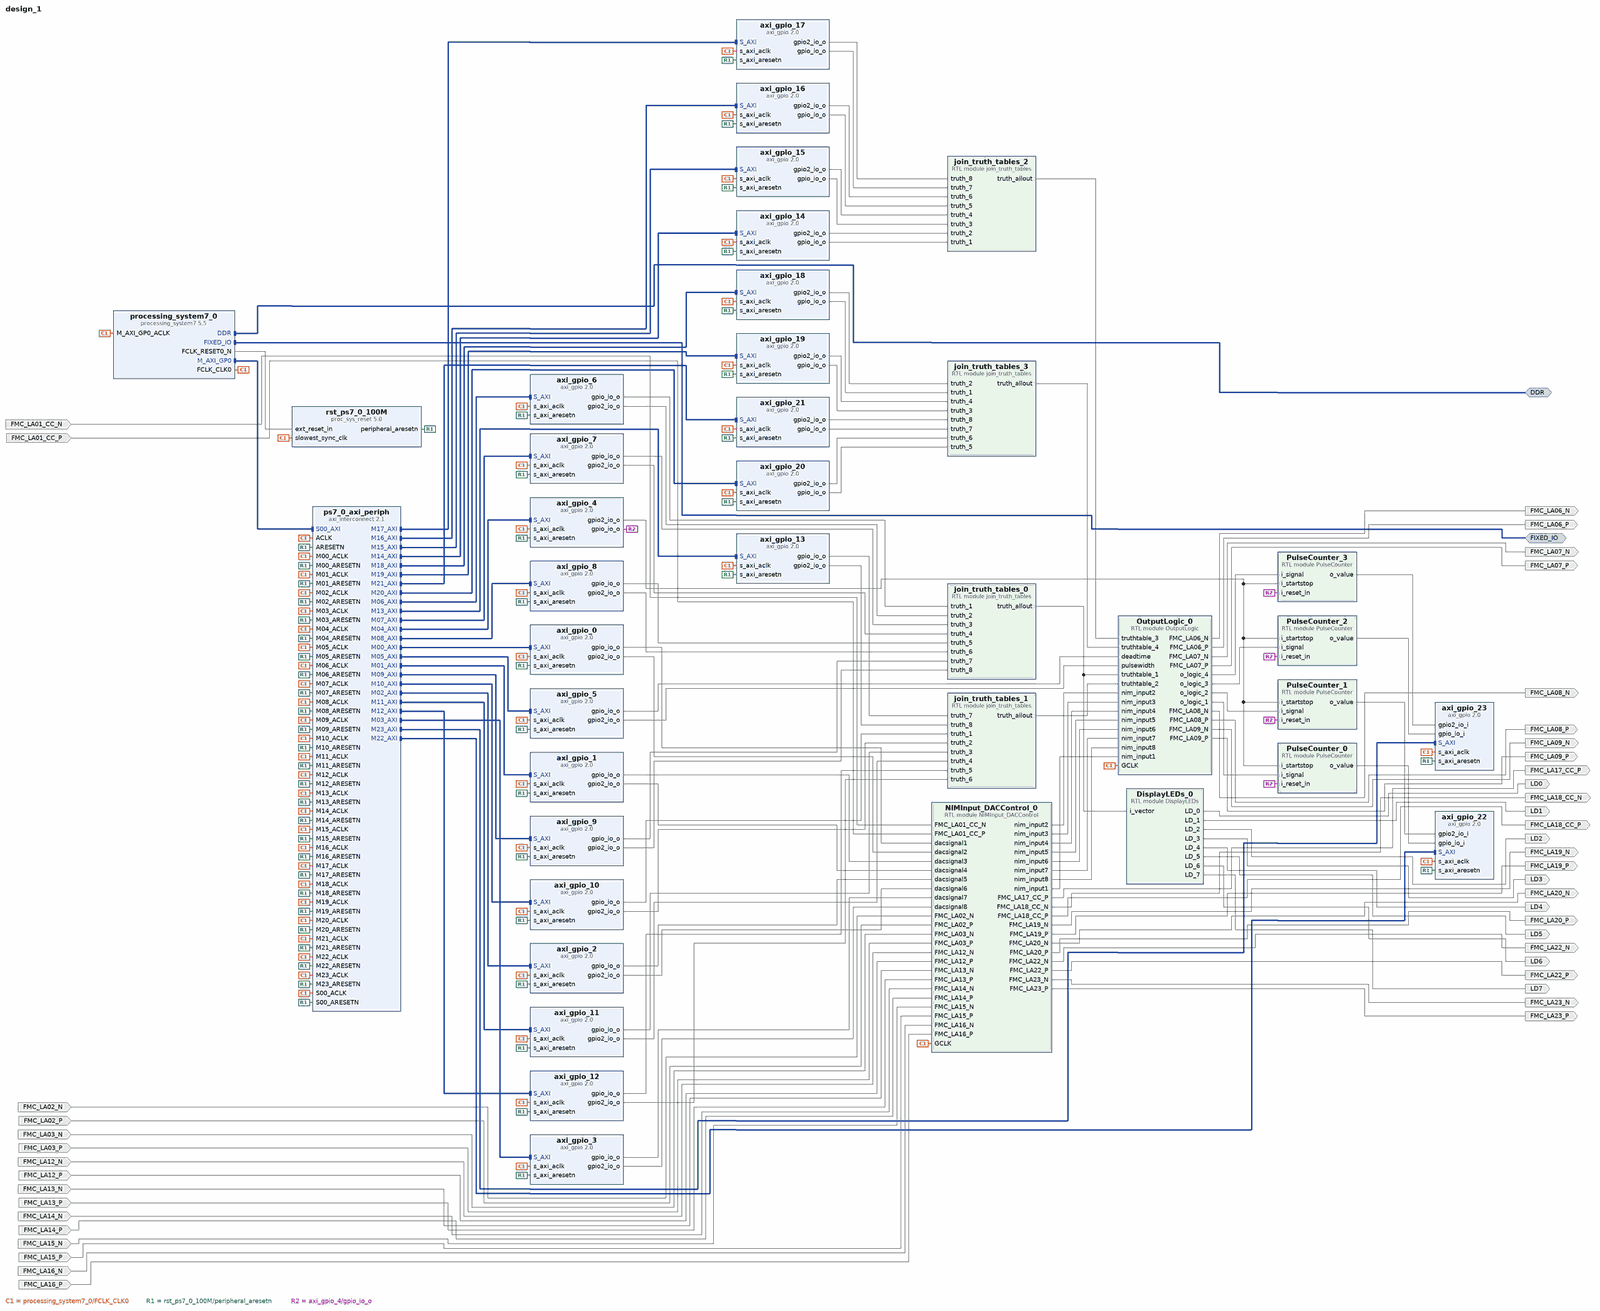
[diagram p0: block diagram of the top level, whole]
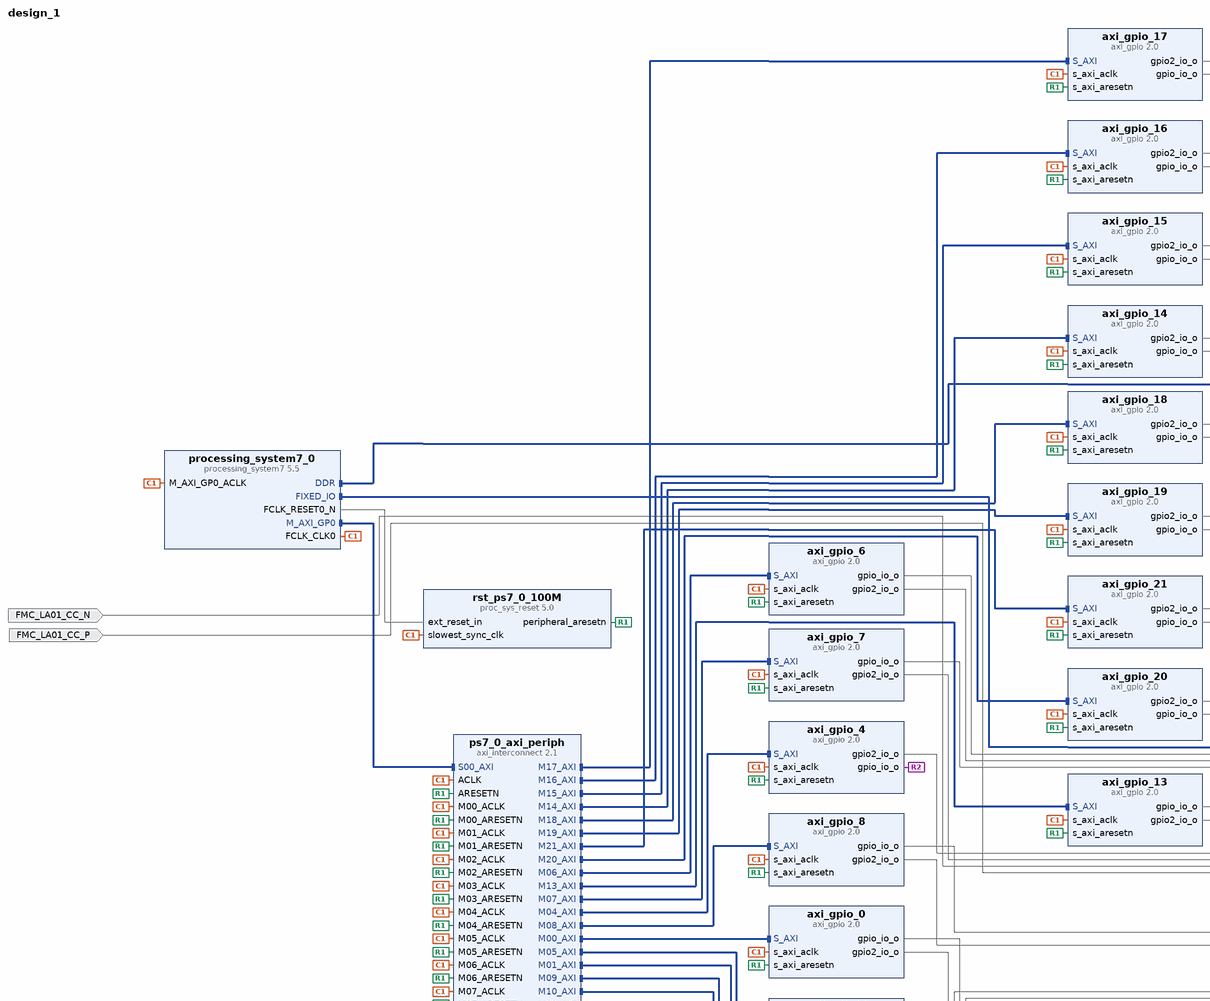
[diagram p1: block diagram of the top level, upper left part]
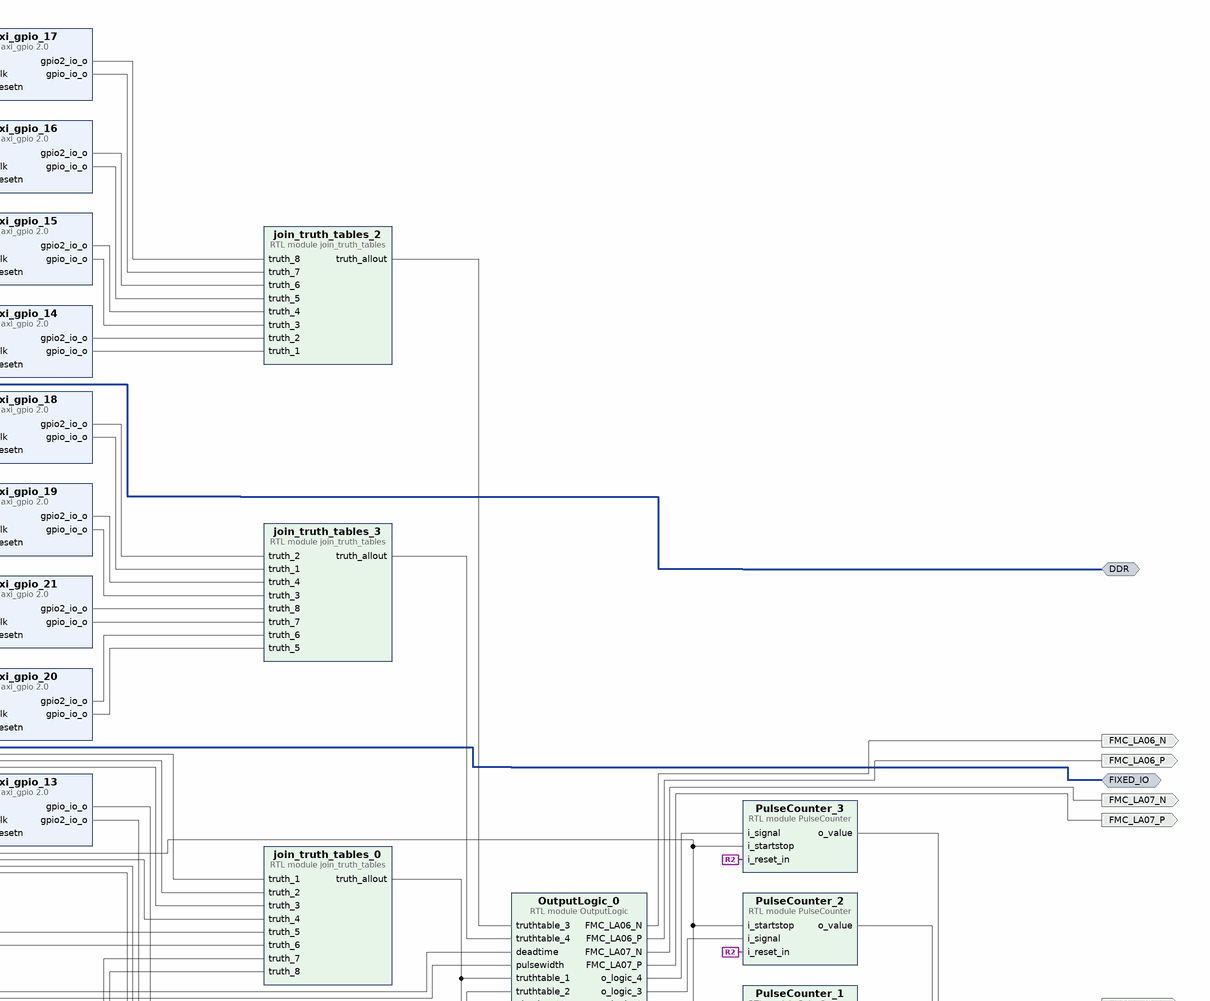
[diagram p2: block diagram of the top level, upper right part]
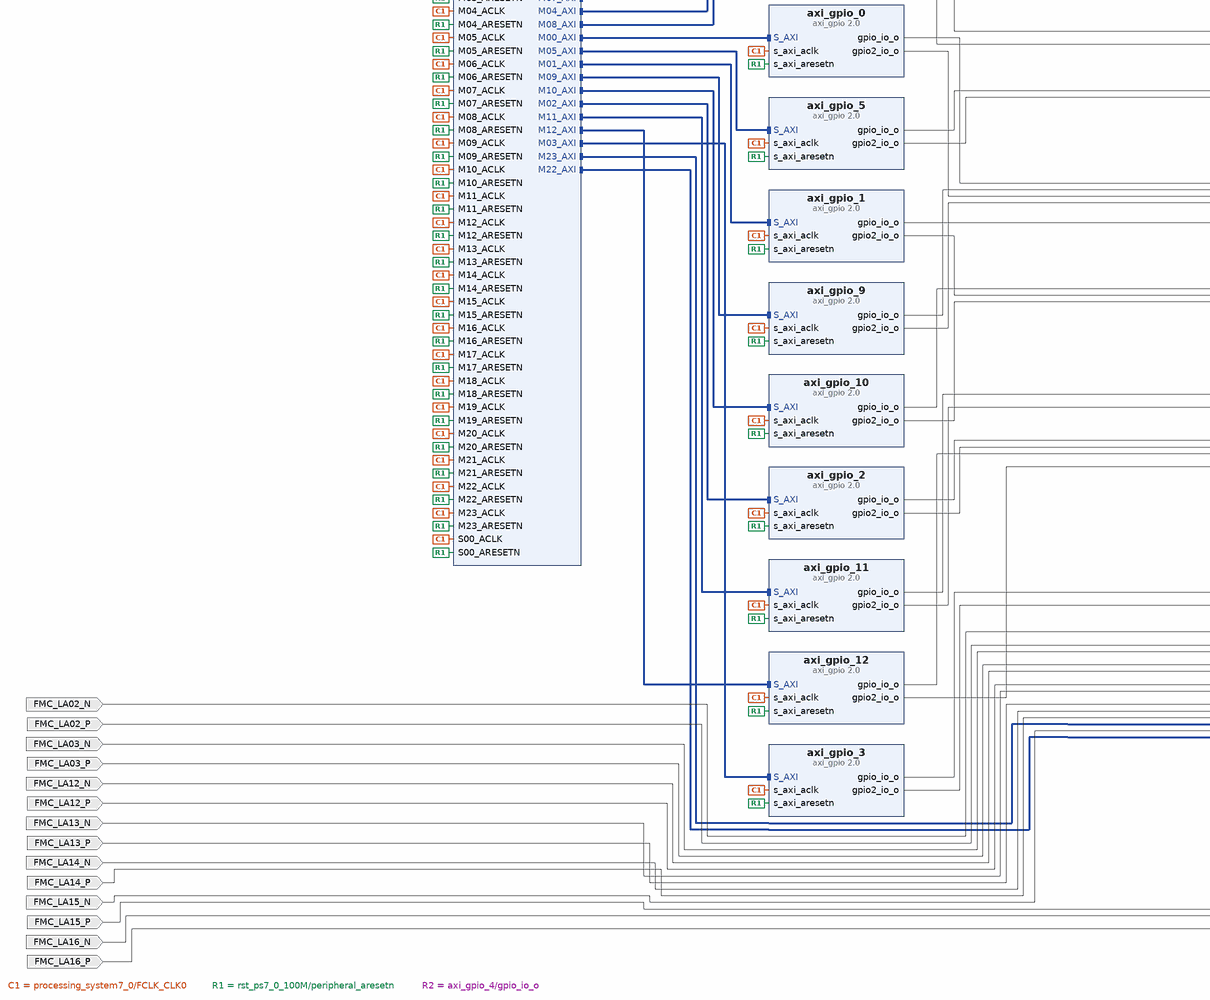
[diagram p3: block diagram of the top level, lower left part]
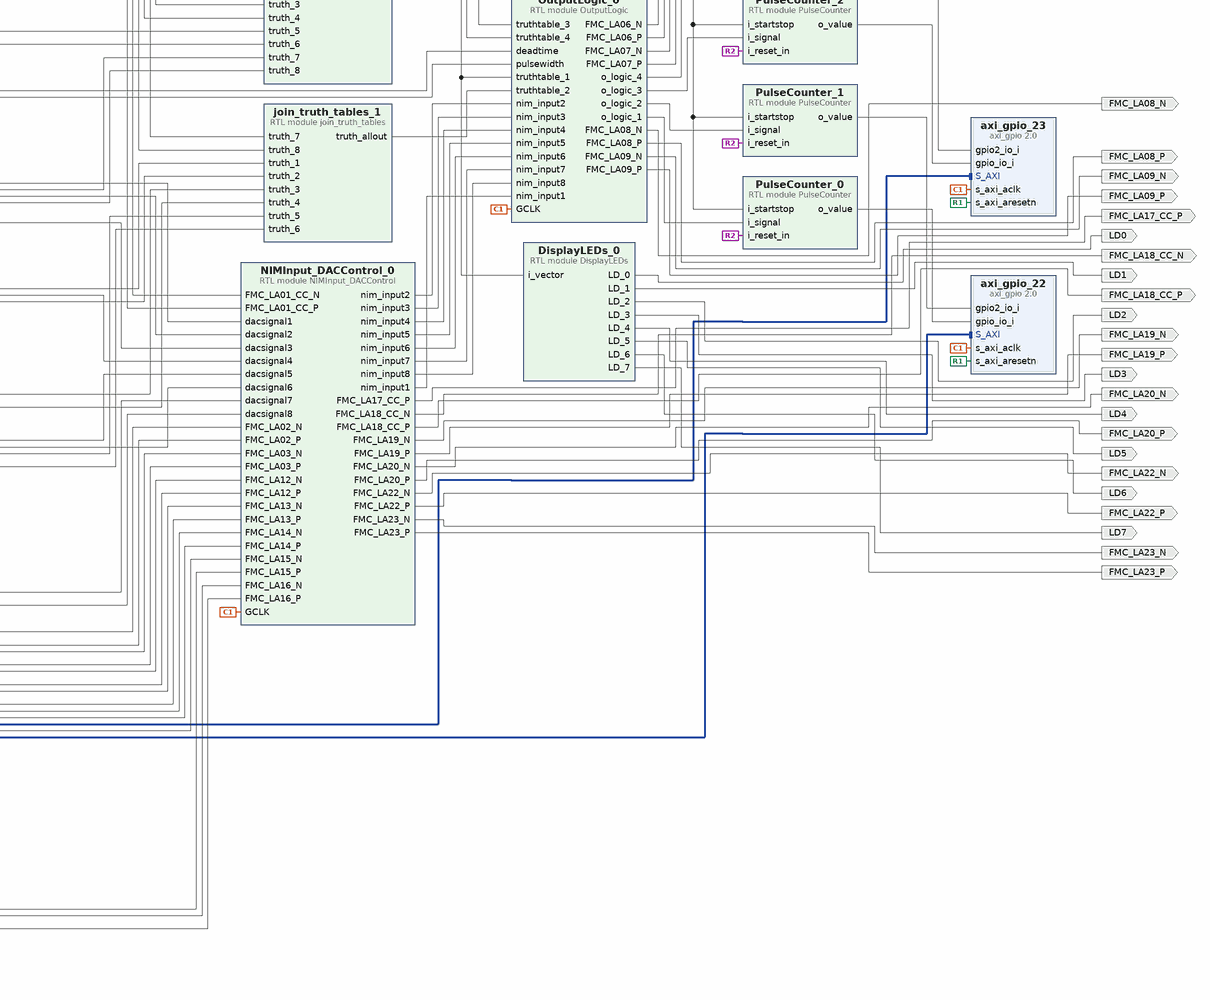
[diagram p4: block diagram of the top level, lower right part]
# Vivado block design design_1, xc7z020clg484-1, Vivado 2019.1
create_bd_design design_1

create_bd_intf_port -mode Master -vlnv xilinx.com:interface:ddrx_rtl:1.0 DDR
create_bd_intf_port -mode Master -vlnv xilinx.com:display_processing_system7:fixedio_rtl:1.0 FIXED_IO
create_bd_port -dir I FMC_LA01_CC_N
create_bd_port -dir I FMC_LA01_CC_P
create_bd_port -dir I FMC_LA02_N
create_bd_port -dir I FMC_LA02_P
create_bd_port -dir I FMC_LA03_N
create_bd_port -dir I FMC_LA03_P
create_bd_port -dir I FMC_LA12_N
create_bd_port -dir I FMC_LA12_P
create_bd_port -dir I FMC_LA13_N
create_bd_port -dir I FMC_LA13_P
create_bd_port -dir I FMC_LA14_N
create_bd_port -dir I FMC_LA14_P
create_bd_port -dir I FMC_LA15_N
create_bd_port -dir I FMC_LA15_P
create_bd_port -dir I FMC_LA16_N
create_bd_port -dir I FMC_LA16_P
create_bd_port -dir O FMC_LA17_CC_P
create_bd_port -dir O FMC_LA18_CC_N
create_bd_port -dir O FMC_LA18_CC_P
create_bd_port -dir O FMC_LA19_N
create_bd_port -dir O FMC_LA19_P
create_bd_port -dir O FMC_LA20_N
create_bd_port -dir O FMC_LA20_P
create_bd_port -dir O FMC_LA22_N
create_bd_port -dir O FMC_LA22_P
create_bd_port -dir O FMC_LA23_N
create_bd_port -dir O FMC_LA23_P
create_bd_port -dir O FMC_LA06_N
create_bd_port -dir O FMC_LA06_P
create_bd_port -dir O FMC_LA07_N
create_bd_port -dir O FMC_LA07_P
create_bd_port -dir O FMC_LA08_N
create_bd_port -dir O FMC_LA08_P
create_bd_port -dir O FMC_LA09_N
create_bd_port -dir O FMC_LA09_P
create_bd_port -dir O LD0
create_bd_port -dir O LD1
create_bd_port -dir O LD2
create_bd_port -dir O LD3
create_bd_port -dir O LD4
create_bd_port -dir O LD5
create_bd_port -dir O LD6
create_bd_port -dir O LD7

create_bd_cell -type ip -vlnv xilinx.com:ip:axi_interconnect:2.1 ps7_0_axi_periph
set_property -dict {CONFIG.NUM_MI 24} [get_bd_cells ps7_0_axi_periph]
create_bd_cell -type module -reference NIMInput_DACControl NIMInput_DACControl_0
create_bd_cell -type module -reference PulseCounter PulseCounter_0
create_bd_cell -type ip -vlnv xilinx.com:ip:axi_gpio:2.0 axi_gpio_0
set_property -dict [list \
  CONFIG.C_ALL_OUTPUTS 1 \
  CONFIG.C_ALL_OUTPUTS_2 1 \
  CONFIG.C_GPIO2_WIDTH 18 \
  CONFIG.C_GPIO_WIDTH 18 \
  CONFIG.C_IS_DUAL 1 \
] [get_bd_cells axi_gpio_0]
create_bd_cell -type ip -vlnv xilinx.com:ip:axi_gpio:2.0 axi_gpio_1
set_property -dict [list \
  CONFIG.C_ALL_OUTPUTS 1 \
  CONFIG.C_ALL_OUTPUTS_2 1 \
  CONFIG.C_GPIO2_WIDTH 18 \
  CONFIG.C_GPIO_WIDTH 18 \
  CONFIG.C_IS_DUAL 1 \
] [get_bd_cells axi_gpio_1]
create_bd_cell -type ip -vlnv xilinx.com:ip:axi_gpio:2.0 axi_gpio_2
set_property -dict [list \
  CONFIG.C_ALL_OUTPUTS 1 \
  CONFIG.C_ALL_OUTPUTS_2 1 \
  CONFIG.C_GPIO2_WIDTH 18 \
  CONFIG.C_GPIO_WIDTH 18 \
  CONFIG.C_IS_DUAL 1 \
] [get_bd_cells axi_gpio_2]
create_bd_cell -type ip -vlnv xilinx.com:ip:axi_gpio:2.0 axi_gpio_3
set_property -dict [list \
  CONFIG.C_ALL_OUTPUTS 1 \
  CONFIG.C_ALL_OUTPUTS_2 1 \
  CONFIG.C_GPIO2_WIDTH 18 \
  CONFIG.C_GPIO_WIDTH 18 \
  CONFIG.C_IS_DUAL 1 \
] [get_bd_cells axi_gpio_3]
create_bd_cell -type ip -vlnv xilinx.com:ip:axi_gpio:2.0 axi_gpio_4
set_property -dict [list \
  CONFIG.C_ALL_OUTPUTS 1 \
  CONFIG.C_ALL_OUTPUTS_2 1 \
  CONFIG.C_DOUT_DEFAULT 0x00000000 \
  CONFIG.C_DOUT_DEFAULT_2 0x00000000 \
  CONFIG.C_GPIO2_WIDTH 1 \
  CONFIG.C_GPIO_WIDTH 1 \
  CONFIG.C_IS_DUAL 1 \
] [get_bd_cells axi_gpio_4]
create_bd_cell -type ip -vlnv xilinx.com:ip:processing_system7:5.5 processing_system7_0
set_property -dict [list \
  CONFIG.PCW_APU_PERIPHERAL_FREQMHZ 666.666667 \
  CONFIG.PCW_ENET0_ENET0_IO {MIO 16 .. 27} \
  CONFIG.PCW_ENET0_GRP_MDIO_ENABLE 1 \
  CONFIG.PCW_ENET0_GRP_MDIO_IO {MIO 52 .. 53} \
  CONFIG.PCW_ENET0_PERIPHERAL_ENABLE 1 \
  CONFIG.PCW_ENET0_RESET_ENABLE 0 \
  CONFIG.PCW_ENET_RESET_ENABLE 1 \
  CONFIG.PCW_ENET_RESET_SELECT {Share reset pin} \
  CONFIG.PCW_FPGA0_PERIPHERAL_FREQMHZ 100.000000 \
  CONFIG.PCW_FPGA1_PERIPHERAL_FREQMHZ 150.000000 \
  CONFIG.PCW_FPGA2_PERIPHERAL_FREQMHZ 50.000000 \
  CONFIG.PCW_GPIO_MIO_GPIO_ENABLE 1 \
  CONFIG.PCW_GPIO_MIO_GPIO_IO MIO \
  CONFIG.PCW_I2C_RESET_ENABLE 1 \
  CONFIG.PCW_PERIPHERAL_BOARD_PRESET part0 \
  CONFIG.PCW_PRESET_BANK1_VOLTAGE {LVCMOS 1.8V} \
  CONFIG.PCW_QSPI_GRP_SINGLE_SS_ENABLE 1 \
  CONFIG.PCW_QSPI_GRP_SINGLE_SS_IO {MIO 1 .. 6} \
  CONFIG.PCW_QSPI_PERIPHERAL_ENABLE 1 \
  CONFIG.PCW_QSPI_PERIPHERAL_FREQMHZ 200.000000 \
  CONFIG.PCW_QSPI_QSPI_IO {MIO 1 .. 6} \
  CONFIG.PCW_SD0_GRP_CD_ENABLE 1 \
  CONFIG.PCW_SD0_GRP_CD_IO {MIO 47} \
  CONFIG.PCW_SD0_GRP_WP_ENABLE 1 \
  CONFIG.PCW_SD0_GRP_WP_IO {MIO 46} \
  CONFIG.PCW_SD0_PERIPHERAL_ENABLE 1 \
  CONFIG.PCW_SD0_SD0_IO {MIO 40 .. 45} \
  CONFIG.PCW_SDIO_PERIPHERAL_FREQMHZ 50 \
  CONFIG.PCW_SINGLE_QSPI_DATA_MODE x4 \
  CONFIG.PCW_TTC0_PERIPHERAL_ENABLE 1 \
  CONFIG.PCW_TTC0_TTC0_IO EMIO \
  CONFIG.PCW_UART1_PERIPHERAL_ENABLE 1 \
  CONFIG.PCW_UART1_UART1_IO {MIO 48 .. 49} \
  CONFIG.PCW_UART_PERIPHERAL_FREQMHZ 50 \
  CONFIG.PCW_UIPARAM_DDR_FREQ_MHZ 533.333313 \
  CONFIG.PCW_UIPARAM_DDR_PARTNO {MT41J128M16 HA-15E} \
  CONFIG.PCW_USB0_PERIPHERAL_ENABLE 1 \
  CONFIG.PCW_USB0_RESET_ENABLE 0 \
  CONFIG.PCW_USB0_USB0_IO {MIO 28 .. 39} \
  CONFIG.PCW_USB_RESET_ENABLE 1 \
  CONFIG.PCW_USB_RESET_SELECT {Share reset pin} \
  CONFIG.preset ZedBoard \
] [get_bd_cells processing_system7_0]
# 500 more settings of processing_system7_0 are not shown: defaults, MIO pin electricals, DDR timing, and values the tool derives
create_bd_cell -type ip -vlnv xilinx.com:ip:proc_sys_reset:5.0 rst_ps7_0_100M
create_bd_cell -type module -reference PulseCounter PulseCounter_1
create_bd_cell -type module -reference PulseCounter PulseCounter_2
create_bd_cell -type module -reference PulseCounter PulseCounter_3
create_bd_cell -type ip -vlnv xilinx.com:ip:axi_gpio:2.0 axi_gpio_5
set_property -dict [list \
  CONFIG.C_ALL_OUTPUTS 1 \
  CONFIG.C_ALL_OUTPUTS_2 1 \
  CONFIG.C_DOUT_DEFAULT 0x00000064 \
  CONFIG.C_DOUT_DEFAULT_2 0x00000005 \
  CONFIG.C_IS_DUAL 1 \
] [get_bd_cells axi_gpio_5]
create_bd_cell -type ip -vlnv xilinx.com:ip:axi_gpio:2.0 axi_gpio_6
set_property -dict [list \
  CONFIG.C_ALL_OUTPUTS 1 \
  CONFIG.C_ALL_OUTPUTS_2 1 \
  CONFIG.C_GPIO2_WIDTH 32 \
  CONFIG.C_GPIO_WIDTH 32 \
  CONFIG.C_IS_DUAL 1 \
] [get_bd_cells axi_gpio_6]
create_bd_cell -type ip -vlnv xilinx.com:ip:axi_gpio:2.0 axi_gpio_7
set_property -dict [list \
  CONFIG.C_ALL_OUTPUTS 1 \
  CONFIG.C_ALL_OUTPUTS_2 1 \
  CONFIG.C_GPIO2_WIDTH 32 \
  CONFIG.C_GPIO_WIDTH 32 \
  CONFIG.C_IS_DUAL 1 \
] [get_bd_cells axi_gpio_7]
create_bd_cell -type ip -vlnv xilinx.com:ip:axi_gpio:2.0 axi_gpio_8
set_property -dict [list \
  CONFIG.C_ALL_OUTPUTS 1 \
  CONFIG.C_ALL_OUTPUTS_2 1 \
  CONFIG.C_GPIO2_WIDTH 32 \
  CONFIG.C_GPIO_WIDTH 32 \
  CONFIG.C_IS_DUAL 1 \
] [get_bd_cells axi_gpio_8]
create_bd_cell -type ip -vlnv xilinx.com:ip:axi_gpio:2.0 axi_gpio_9
set_property -dict [list \
  CONFIG.C_ALL_OUTPUTS 1 \
  CONFIG.C_ALL_OUTPUTS_2 1 \
  CONFIG.C_DOUT_DEFAULT_2 0x000000F0 \
  CONFIG.C_GPIO2_WIDTH 32 \
  CONFIG.C_GPIO_WIDTH 32 \
  CONFIG.C_IS_DUAL 1 \
] [get_bd_cells axi_gpio_9]
create_bd_cell -type module -reference join_truth_tables join_truth_tables_0
create_bd_cell -type ip -vlnv xilinx.com:ip:axi_gpio:2.0 axi_gpio_10
set_property -dict [list \
  CONFIG.C_ALL_INPUTS 0 \
  CONFIG.C_ALL_OUTPUTS 1 \
  CONFIG.C_ALL_OUTPUTS_2 1 \
  CONFIG.C_IS_DUAL 1 \
] [get_bd_cells axi_gpio_10]
create_bd_cell -type module -reference DisplayLEDs DisplayLEDs_0
create_bd_cell -type ip -vlnv xilinx.com:ip:axi_gpio:2.0 axi_gpio_11
set_property -dict [list \
  CONFIG.C_ALL_INPUTS 0 \
  CONFIG.C_ALL_OUTPUTS 1 \
  CONFIG.C_ALL_OUTPUTS_2 1 \
  CONFIG.C_IS_DUAL 1 \
] [get_bd_cells axi_gpio_11]
create_bd_cell -type ip -vlnv xilinx.com:ip:axi_gpio:2.0 axi_gpio_12
set_property -dict [list \
  CONFIG.C_ALL_INPUTS 0 \
  CONFIG.C_ALL_OUTPUTS 1 \
  CONFIG.C_ALL_OUTPUTS_2 1 \
  CONFIG.C_IS_DUAL 1 \
] [get_bd_cells axi_gpio_12]
create_bd_cell -type ip -vlnv xilinx.com:ip:axi_gpio:2.0 axi_gpio_13
set_property -dict [list \
  CONFIG.C_ALL_INPUTS 0 \
  CONFIG.C_ALL_OUTPUTS 1 \
  CONFIG.C_ALL_OUTPUTS_2 1 \
  CONFIG.C_IS_DUAL 1 \
] [get_bd_cells axi_gpio_13]
create_bd_cell -type ip -vlnv xilinx.com:ip:axi_gpio:2.0 axi_gpio_14
set_property -dict [list \
  CONFIG.C_ALL_INPUTS 0 \
  CONFIG.C_ALL_OUTPUTS 1 \
  CONFIG.C_ALL_OUTPUTS_2 1 \
  CONFIG.C_IS_DUAL 1 \
] [get_bd_cells axi_gpio_14]
create_bd_cell -type ip -vlnv xilinx.com:ip:axi_gpio:2.0 axi_gpio_15
set_property -dict [list \
  CONFIG.C_ALL_INPUTS 0 \
  CONFIG.C_ALL_OUTPUTS 1 \
  CONFIG.C_ALL_OUTPUTS_2 1 \
  CONFIG.C_IS_DUAL 1 \
] [get_bd_cells axi_gpio_15]
create_bd_cell -type ip -vlnv xilinx.com:ip:axi_gpio:2.0 axi_gpio_16
set_property -dict [list \
  CONFIG.C_ALL_INPUTS 0 \
  CONFIG.C_ALL_OUTPUTS 1 \
  CONFIG.C_ALL_OUTPUTS_2 1 \
  CONFIG.C_IS_DUAL 1 \
] [get_bd_cells axi_gpio_16]
create_bd_cell -type ip -vlnv xilinx.com:ip:axi_gpio:2.0 axi_gpio_17
set_property -dict [list \
  CONFIG.C_ALL_INPUTS 0 \
  CONFIG.C_ALL_OUTPUTS 1 \
  CONFIG.C_ALL_OUTPUTS_2 1 \
  CONFIG.C_IS_DUAL 1 \
] [get_bd_cells axi_gpio_17]
create_bd_cell -type ip -vlnv xilinx.com:ip:axi_gpio:2.0 axi_gpio_18
set_property -dict [list \
  CONFIG.C_ALL_INPUTS 0 \
  CONFIG.C_ALL_OUTPUTS 1 \
  CONFIG.C_ALL_OUTPUTS_2 1 \
  CONFIG.C_IS_DUAL 1 \
] [get_bd_cells axi_gpio_18]
create_bd_cell -type ip -vlnv xilinx.com:ip:axi_gpio:2.0 axi_gpio_19
set_property -dict [list \
  CONFIG.C_ALL_INPUTS 0 \
  CONFIG.C_ALL_OUTPUTS 1 \
  CONFIG.C_ALL_OUTPUTS_2 1 \
  CONFIG.C_IS_DUAL 1 \
] [get_bd_cells axi_gpio_19]
create_bd_cell -type ip -vlnv xilinx.com:ip:axi_gpio:2.0 axi_gpio_20
set_property -dict [list \
  CONFIG.C_ALL_INPUTS 0 \
  CONFIG.C_ALL_OUTPUTS 1 \
  CONFIG.C_ALL_OUTPUTS_2 1 \
  CONFIG.C_IS_DUAL 1 \
] [get_bd_cells axi_gpio_20]
create_bd_cell -type ip -vlnv xilinx.com:ip:axi_gpio:2.0 axi_gpio_21
set_property -dict [list \
  CONFIG.C_ALL_INPUTS 0 \
  CONFIG.C_ALL_OUTPUTS 1 \
  CONFIG.C_ALL_OUTPUTS_2 1 \
  CONFIG.C_IS_DUAL 1 \
] [get_bd_cells axi_gpio_21]
create_bd_cell -type ip -vlnv xilinx.com:ip:axi_gpio:2.0 axi_gpio_22
set_property -dict {CONFIG.C_ALL_INPUTS 1 CONFIG.C_ALL_INPUTS_2 1 CONFIG.C_IS_DUAL 1} [get_bd_cells axi_gpio_22]
create_bd_cell -type ip -vlnv xilinx.com:ip:axi_gpio:2.0 axi_gpio_23
set_property -dict {CONFIG.C_ALL_INPUTS 1 CONFIG.C_ALL_INPUTS_2 1 CONFIG.C_IS_DUAL 1} [get_bd_cells axi_gpio_23]
create_bd_cell -type module -reference join_truth_tables join_truth_tables_1
create_bd_cell -type module -reference join_truth_tables join_truth_tables_2
create_bd_cell -type module -reference join_truth_tables join_truth_tables_3
create_bd_cell -type module -reference OutputLogic OutputLogic_0

# ---- connections ----

connect_bd_intf_net [get_bd_intf_pins ps7_0_axi_periph/M01_AXI] [get_bd_intf_pins axi_gpio_1/S_AXI]
connect_bd_intf_net [get_bd_intf_pins ps7_0_axi_periph/M00_AXI] [get_bd_intf_pins axi_gpio_0/S_AXI]
connect_bd_intf_net [get_bd_intf_pins ps7_0_axi_periph/M09_AXI] [get_bd_intf_pins axi_gpio_9/S_AXI]
connect_bd_intf_net [get_bd_intf_pins ps7_0_axi_periph/M06_AXI] [get_bd_intf_pins axi_gpio_6/S_AXI]
connect_bd_intf_net [get_bd_intf_pins ps7_0_axi_periph/M07_AXI] [get_bd_intf_pins axi_gpio_7/S_AXI]
connect_bd_intf_net [get_bd_intf_ports DDR] [get_bd_intf_pins processing_system7_0/DDR]
connect_bd_intf_net [get_bd_intf_pins ps7_0_axi_periph/M10_AXI] [get_bd_intf_pins axi_gpio_10/S_AXI]
connect_bd_intf_net [get_bd_intf_pins ps7_0_axi_periph/M02_AXI] [get_bd_intf_pins axi_gpio_2/S_AXI]
connect_bd_intf_net [get_bd_intf_ports FIXED_IO] [get_bd_intf_pins processing_system7_0/FIXED_IO]
connect_bd_intf_net [get_bd_intf_pins ps7_0_axi_periph/M11_AXI] [get_bd_intf_pins axi_gpio_11/S_AXI]
connect_bd_intf_net [get_bd_intf_pins ps7_0_axi_periph/M18_AXI] [get_bd_intf_pins axi_gpio_18/S_AXI]
connect_bd_intf_net [get_bd_intf_pins ps7_0_axi_periph/M04_AXI] [get_bd_intf_pins axi_gpio_4/S_AXI]
connect_bd_intf_net [get_bd_intf_pins ps7_0_axi_periph/M03_AXI] [get_bd_intf_pins axi_gpio_3/S_AXI]
connect_bd_intf_net [get_bd_intf_pins ps7_0_axi_periph/M05_AXI] [get_bd_intf_pins axi_gpio_5/S_AXI]
connect_bd_intf_net [get_bd_intf_pins processing_system7_0/M_AXI_GP0] [get_bd_intf_pins ps7_0_axi_periph/S00_AXI]
connect_bd_intf_net [get_bd_intf_pins ps7_0_axi_periph/M08_AXI] [get_bd_intf_pins axi_gpio_8/S_AXI]
connect_bd_intf_net [get_bd_intf_pins ps7_0_axi_periph/M12_AXI] [get_bd_intf_pins axi_gpio_12/S_AXI]
connect_bd_intf_net [get_bd_intf_pins ps7_0_axi_periph/M17_AXI] [get_bd_intf_pins axi_gpio_17/S_AXI]
connect_bd_intf_net [get_bd_intf_pins ps7_0_axi_periph/M21_AXI] [get_bd_intf_pins axi_gpio_21/S_AXI]
connect_bd_intf_net [get_bd_intf_pins ps7_0_axi_periph/M13_AXI] [get_bd_intf_pins axi_gpio_13/S_AXI]
connect_bd_intf_net [get_bd_intf_pins ps7_0_axi_periph/M19_AXI] [get_bd_intf_pins axi_gpio_19/S_AXI]
connect_bd_intf_net [get_bd_intf_pins ps7_0_axi_periph/M20_AXI] [get_bd_intf_pins axi_gpio_20/S_AXI]
connect_bd_intf_net [get_bd_intf_pins ps7_0_axi_periph/M16_AXI] [get_bd_intf_pins axi_gpio_16/S_AXI]
connect_bd_intf_net [get_bd_intf_pins ps7_0_axi_periph/M23_AXI] [get_bd_intf_pins axi_gpio_23/S_AXI]
connect_bd_intf_net [get_bd_intf_pins ps7_0_axi_periph/M15_AXI] [get_bd_intf_pins axi_gpio_15/S_AXI]
connect_bd_intf_net [get_bd_intf_pins ps7_0_axi_periph/M14_AXI] [get_bd_intf_pins axi_gpio_14/S_AXI]
connect_bd_intf_net [get_bd_intf_pins ps7_0_axi_periph/M22_AXI] [get_bd_intf_pins axi_gpio_22/S_AXI]
connect_bd_net [get_bd_pins processing_system7_0/FCLK_CLK0] \
  [get_bd_pins ps7_0_axi_periph/S00_ACLK] [get_bd_pins ps7_0_axi_periph/M00_ACLK] [get_bd_pins ps7_0_axi_periph/ACLK] \
  [get_bd_pins ps7_0_axi_periph/M01_ACLK] [get_bd_pins ps7_0_axi_periph/M02_ACLK] [get_bd_pins ps7_0_axi_periph/M03_ACLK] \
  [get_bd_pins ps7_0_axi_periph/M04_ACLK] [get_bd_pins ps7_0_axi_periph/M05_ACLK] [get_bd_pins NIMInput_DACControl_0/GCLK] \
  [get_bd_pins ps7_0_axi_periph/M06_ACLK] [get_bd_pins ps7_0_axi_periph/M07_ACLK] [get_bd_pins ps7_0_axi_periph/M08_ACLK] \
  [get_bd_pins axi_gpio_0/s_axi_aclk] [get_bd_pins axi_gpio_1/s_axi_aclk] [get_bd_pins axi_gpio_2/s_axi_aclk] \
  [get_bd_pins axi_gpio_3/s_axi_aclk] [get_bd_pins axi_gpio_4/s_axi_aclk] [get_bd_pins processing_system7_0/M_AXI_GP0_ACLK] \
  [get_bd_pins rst_ps7_0_100M/slowest_sync_clk] [get_bd_pins axi_gpio_5/s_axi_aclk] [get_bd_pins axi_gpio_6/s_axi_aclk] \
  [get_bd_pins axi_gpio_7/s_axi_aclk] [get_bd_pins axi_gpio_8/s_axi_aclk] [get_bd_pins axi_gpio_9/s_axi_aclk] \
  [get_bd_pins ps7_0_axi_periph/M09_ACLK] [get_bd_pins ps7_0_axi_periph/M10_ACLK] [get_bd_pins axi_gpio_10/s_axi_aclk] \
  [get_bd_pins axi_gpio_11/s_axi_aclk] [get_bd_pins ps7_0_axi_periph/M11_ACLK] [get_bd_pins axi_gpio_12/s_axi_aclk] \
  [get_bd_pins ps7_0_axi_periph/M12_ACLK] [get_bd_pins axi_gpio_13/s_axi_aclk] [get_bd_pins ps7_0_axi_periph/M13_ACLK] \
  [get_bd_pins axi_gpio_14/s_axi_aclk] [get_bd_pins ps7_0_axi_periph/M14_ACLK] [get_bd_pins axi_gpio_15/s_axi_aclk] \
  [get_bd_pins ps7_0_axi_periph/M15_ACLK] [get_bd_pins axi_gpio_16/s_axi_aclk] [get_bd_pins ps7_0_axi_periph/M16_ACLK] \
  [get_bd_pins axi_gpio_17/s_axi_aclk] [get_bd_pins ps7_0_axi_periph/M17_ACLK] [get_bd_pins axi_gpio_18/s_axi_aclk] \
  [get_bd_pins ps7_0_axi_periph/M18_ACLK] [get_bd_pins axi_gpio_19/s_axi_aclk] [get_bd_pins ps7_0_axi_periph/M19_ACLK] \
  [get_bd_pins axi_gpio_20/s_axi_aclk] [get_bd_pins ps7_0_axi_periph/M20_ACLK] [get_bd_pins axi_gpio_21/s_axi_aclk] \
  [get_bd_pins ps7_0_axi_periph/M21_ACLK] [get_bd_pins axi_gpio_22/s_axi_aclk] [get_bd_pins ps7_0_axi_periph/M22_ACLK] \
  [get_bd_pins axi_gpio_23/s_axi_aclk] [get_bd_pins ps7_0_axi_periph/M23_ACLK] [get_bd_pins OutputLogic_0/GCLK]
connect_bd_net [get_bd_pins processing_system7_0/FCLK_RESET0_N] [get_bd_pins rst_ps7_0_100M/ext_reset_in]
connect_bd_net [get_bd_pins rst_ps7_0_100M/peripheral_aresetn] \
  [get_bd_pins ps7_0_axi_periph/S00_ARESETN] [get_bd_pins ps7_0_axi_periph/M00_ARESETN] \
  [get_bd_pins ps7_0_axi_periph/ARESETN] [get_bd_pins ps7_0_axi_periph/M01_ARESETN] \
  [get_bd_pins ps7_0_axi_periph/M02_ARESETN] [get_bd_pins ps7_0_axi_periph/M03_ARESETN] \
  [get_bd_pins ps7_0_axi_periph/M04_ARESETN] [get_bd_pins ps7_0_axi_periph/M05_ARESETN] \
  [get_bd_pins ps7_0_axi_periph/M06_ARESETN] [get_bd_pins ps7_0_axi_periph/M07_ARESETN] \
  [get_bd_pins ps7_0_axi_periph/M08_ARESETN] [get_bd_pins axi_gpio_0/s_axi_aresetn] [get_bd_pins axi_gpio_1/s_axi_aresetn] \
  [get_bd_pins axi_gpio_2/s_axi_aresetn] [get_bd_pins axi_gpio_3/s_axi_aresetn] [get_bd_pins axi_gpio_4/s_axi_aresetn] \
  [get_bd_pins axi_gpio_5/s_axi_aresetn] [get_bd_pins axi_gpio_6/s_axi_aresetn] [get_bd_pins axi_gpio_7/s_axi_aresetn] \
  [get_bd_pins axi_gpio_8/s_axi_aresetn] [get_bd_pins axi_gpio_9/s_axi_aresetn] [get_bd_pins ps7_0_axi_periph/M09_ARESETN] \
  [get_bd_pins ps7_0_axi_periph/M10_ARESETN] [get_bd_pins axi_gpio_10/s_axi_aresetn] [get_bd_pins axi_gpio_11/s_axi_aresetn] \
  [get_bd_pins ps7_0_axi_periph/M11_ARESETN] [get_bd_pins axi_gpio_12/s_axi_aresetn] \
  [get_bd_pins ps7_0_axi_periph/M12_ARESETN] [get_bd_pins axi_gpio_13/s_axi_aresetn] \
  [get_bd_pins ps7_0_axi_periph/M13_ARESETN] [get_bd_pins axi_gpio_14/s_axi_aresetn] \
  [get_bd_pins ps7_0_axi_periph/M14_ARESETN] [get_bd_pins axi_gpio_15/s_axi_aresetn] \
  [get_bd_pins ps7_0_axi_periph/M15_ARESETN] [get_bd_pins axi_gpio_16/s_axi_aresetn] \
  [get_bd_pins ps7_0_axi_periph/M16_ARESETN] [get_bd_pins axi_gpio_17/s_axi_aresetn] \
  [get_bd_pins ps7_0_axi_periph/M17_ARESETN] [get_bd_pins axi_gpio_18/s_axi_aresetn] \
  [get_bd_pins ps7_0_axi_periph/M18_ARESETN] [get_bd_pins axi_gpio_19/s_axi_aresetn] \
  [get_bd_pins ps7_0_axi_periph/M19_ARESETN] [get_bd_pins axi_gpio_20/s_axi_aresetn] \
  [get_bd_pins ps7_0_axi_periph/M20_ARESETN] [get_bd_pins axi_gpio_21/s_axi_aresetn] \
  [get_bd_pins ps7_0_axi_periph/M21_ARESETN] [get_bd_pins axi_gpio_22/s_axi_aresetn] \
  [get_bd_pins ps7_0_axi_periph/M22_ARESETN] [get_bd_pins axi_gpio_23/s_axi_aresetn] \
  [get_bd_pins ps7_0_axi_periph/M23_ARESETN]
connect_bd_net [get_bd_pins axi_gpio_0/gpio_io_o] [get_bd_pins NIMInput_DACControl_0/dacsignal1]
connect_bd_net [get_bd_pins axi_gpio_0/gpio2_io_o] [get_bd_pins NIMInput_DACControl_0/dacsignal2]
connect_bd_net [get_bd_pins axi_gpio_1/gpio_io_o] [get_bd_pins NIMInput_DACControl_0/dacsignal3]
connect_bd_net [get_bd_pins axi_gpio_1/gpio2_io_o] [get_bd_pins NIMInput_DACControl_0/dacsignal4]
connect_bd_net [get_bd_pins axi_gpio_2/gpio_io_o] [get_bd_pins NIMInput_DACControl_0/dacsignal5]
connect_bd_net [get_bd_pins axi_gpio_2/gpio2_io_o] [get_bd_pins NIMInput_DACControl_0/dacsignal6]
connect_bd_net [get_bd_pins axi_gpio_3/gpio_io_o] [get_bd_pins NIMInput_DACControl_0/dacsignal7]
connect_bd_net [get_bd_pins axi_gpio_3/gpio2_io_o] [get_bd_pins NIMInput_DACControl_0/dacsignal8]
connect_bd_net [get_bd_pins NIMInput_DACControl_0/nim_input2] [get_bd_pins OutputLogic_0/nim_input2]
connect_bd_net [get_bd_pins NIMInput_DACControl_0/nim_input3] [get_bd_pins OutputLogic_0/nim_input3]
connect_bd_net [get_bd_pins NIMInput_DACControl_0/nim_input4] [get_bd_pins OutputLogic_0/nim_input4]
connect_bd_net [get_bd_pins NIMInput_DACControl_0/nim_input5] [get_bd_pins OutputLogic_0/nim_input5]
connect_bd_net [get_bd_pins NIMInput_DACControl_0/nim_input6] [get_bd_pins OutputLogic_0/nim_input6]
connect_bd_net [get_bd_pins NIMInput_DACControl_0/nim_input7] [get_bd_pins OutputLogic_0/nim_input7]
connect_bd_net [get_bd_pins NIMInput_DACControl_0/nim_input8] [get_bd_pins OutputLogic_0/nim_input8]
connect_bd_net -net FMC_LA01_CC_N_0_1 [get_bd_ports FMC_LA01_CC_N] [get_bd_pins NIMInput_DACControl_0/FMC_LA01_CC_N]
connect_bd_net -net FMC_LA01_CC_P_0_1 [get_bd_ports FMC_LA01_CC_P] [get_bd_pins NIMInput_DACControl_0/FMC_LA01_CC_P]
connect_bd_net -net FMC_LA02_N_0_1 [get_bd_ports FMC_LA02_N] [get_bd_pins NIMInput_DACControl_0/FMC_LA02_N]
connect_bd_net -net FMC_LA02_P_0_1 [get_bd_ports FMC_LA02_P] [get_bd_pins NIMInput_DACControl_0/FMC_LA02_P]
connect_bd_net -net FMC_LA03_N_0_1 [get_bd_ports FMC_LA03_N] [get_bd_pins NIMInput_DACControl_0/FMC_LA03_N]
connect_bd_net -net FMC_LA03_P_0_1 [get_bd_ports FMC_LA03_P] [get_bd_pins NIMInput_DACControl_0/FMC_LA03_P]
connect_bd_net -net FMC_LA12_N_0_1 [get_bd_ports FMC_LA12_N] [get_bd_pins NIMInput_DACControl_0/FMC_LA12_N]
connect_bd_net -net FMC_LA12_P_0_1 [get_bd_ports FMC_LA12_P] [get_bd_pins NIMInput_DACControl_0/FMC_LA12_P]
connect_bd_net -net FMC_LA13_N_0_1 [get_bd_ports FMC_LA13_N] [get_bd_pins NIMInput_DACControl_0/FMC_LA13_N]
connect_bd_net -net FMC_LA13_P_0_1 [get_bd_ports FMC_LA13_P] [get_bd_pins NIMInput_DACControl_0/FMC_LA13_P]
connect_bd_net -net FMC_LA14_N_0_1 [get_bd_ports FMC_LA14_N] [get_bd_pins NIMInput_DACControl_0/FMC_LA14_N]
connect_bd_net -net FMC_LA14_P_0_1 [get_bd_ports FMC_LA14_P] [get_bd_pins NIMInput_DACControl_0/FMC_LA14_P]
connect_bd_net -net FMC_LA15_N_0_1 [get_bd_ports FMC_LA15_N] [get_bd_pins NIMInput_DACControl_0/FMC_LA15_N]
connect_bd_net -net FMC_LA15_P_0_1 [get_bd_ports FMC_LA15_P] [get_bd_pins NIMInput_DACControl_0/FMC_LA15_P]
connect_bd_net -net FMC_LA16_N_0_1 [get_bd_ports FMC_LA16_N] [get_bd_pins NIMInput_DACControl_0/FMC_LA16_N]
connect_bd_net -net FMC_LA16_P_0_1 [get_bd_ports FMC_LA16_P] [get_bd_pins NIMInput_DACControl_0/FMC_LA16_P]
connect_bd_net [get_bd_pins NIMInput_DACControl_0/FMC_LA17_CC_P] [get_bd_ports FMC_LA17_CC_P]
connect_bd_net [get_bd_pins NIMInput_DACControl_0/FMC_LA18_CC_N] [get_bd_ports FMC_LA18_CC_N]
connect_bd_net [get_bd_pins NIMInput_DACControl_0/FMC_LA18_CC_P] [get_bd_ports FMC_LA18_CC_P]
connect_bd_net [get_bd_pins NIMInput_DACControl_0/FMC_LA19_N] [get_bd_ports FMC_LA19_N]
connect_bd_net [get_bd_pins NIMInput_DACControl_0/FMC_LA19_P] [get_bd_ports FMC_LA19_P]
connect_bd_net [get_bd_pins NIMInput_DACControl_0/FMC_LA20_N] [get_bd_ports FMC_LA20_N]
connect_bd_net [get_bd_pins NIMInput_DACControl_0/FMC_LA20_P] [get_bd_ports FMC_LA20_P]
connect_bd_net [get_bd_pins NIMInput_DACControl_0/FMC_LA22_N] [get_bd_ports FMC_LA22_N]
connect_bd_net [get_bd_pins NIMInput_DACControl_0/FMC_LA22_P] [get_bd_ports FMC_LA22_P]
connect_bd_net [get_bd_pins NIMInput_DACControl_0/FMC_LA23_N] [get_bd_ports FMC_LA23_N]
connect_bd_net [get_bd_pins NIMInput_DACControl_0/FMC_LA23_P] [get_bd_ports FMC_LA23_P]
connect_bd_net [get_bd_pins OutputLogic_0/FMC_LA06_N] [get_bd_ports FMC_LA06_N]
connect_bd_net [get_bd_pins OutputLogic_0/FMC_LA06_P] [get_bd_ports FMC_LA06_P]
connect_bd_net [get_bd_pins OutputLogic_0/FMC_LA07_N] [get_bd_ports FMC_LA07_N]
connect_bd_net [get_bd_pins OutputLogic_0/FMC_LA07_P] [get_bd_ports FMC_LA07_P]
connect_bd_net [get_bd_pins OutputLogic_0/FMC_LA08_N] [get_bd_ports FMC_LA08_N]
connect_bd_net [get_bd_pins OutputLogic_0/FMC_LA08_P] [get_bd_ports FMC_LA08_P]
connect_bd_net [get_bd_pins OutputLogic_0/FMC_LA09_N] [get_bd_ports FMC_LA09_N]
connect_bd_net [get_bd_pins OutputLogic_0/FMC_LA09_P] [get_bd_ports FMC_LA09_P]
connect_bd_net [get_bd_pins NIMInput_DACControl_0/nim_input1] [get_bd_pins OutputLogic_0/nim_input1]
connect_bd_net [get_bd_pins DisplayLEDs_0/LD_0] [get_bd_ports LD0]
connect_bd_net [get_bd_pins DisplayLEDs_0/LD_1] [get_bd_ports LD1]
connect_bd_net [get_bd_pins DisplayLEDs_0/LD_2] [get_bd_ports LD2]
connect_bd_net [get_bd_pins DisplayLEDs_0/LD_3] [get_bd_ports LD3]
connect_bd_net [get_bd_pins DisplayLEDs_0/LD_4] [get_bd_ports LD4]
connect_bd_net [get_bd_pins DisplayLEDs_0/LD_5] [get_bd_ports LD5]
connect_bd_net [get_bd_pins DisplayLEDs_0/LD_6] [get_bd_ports LD6]
connect_bd_net [get_bd_pins DisplayLEDs_0/LD_7] [get_bd_ports LD7]
connect_bd_net [get_bd_pins axi_gpio_5/gpio_io_o] [get_bd_pins OutputLogic_0/deadtime]
connect_bd_net [get_bd_pins axi_gpio_5/gpio2_io_o] [get_bd_pins OutputLogic_0/pulsewidth]
connect_bd_net [get_bd_pins OutputLogic_0/o_logic_1] [get_bd_pins PulseCounter_0/i_signal]
connect_bd_net [get_bd_pins OutputLogic_0/o_logic_2] [get_bd_pins PulseCounter_1/i_signal]
connect_bd_net [get_bd_pins OutputLogic_0/o_logic_3] [get_bd_pins PulseCounter_2/i_signal]
connect_bd_net [get_bd_pins OutputLogic_0/o_logic_4] [get_bd_pins PulseCounter_3/i_signal]
connect_bd_net [get_bd_pins axi_gpio_4/gpio_io_o] \
  [get_bd_pins PulseCounter_0/i_reset_in] [get_bd_pins PulseCounter_1/i_reset_in] [get_bd_pins PulseCounter_2/i_reset_in] \
  [get_bd_pins PulseCounter_3/i_reset_in]
connect_bd_net [get_bd_pins axi_gpio_4/gpio2_io_o] \
  [get_bd_pins PulseCounter_0/i_startstop] [get_bd_pins PulseCounter_1/i_startstop] [get_bd_pins PulseCounter_2/i_startstop] \
  [get_bd_pins PulseCounter_3/i_startstop]
connect_bd_net [get_bd_pins axi_gpio_6/gpio_io_o] [get_bd_pins join_truth_tables_0/truth_1]
connect_bd_net [get_bd_pins axi_gpio_6/gpio2_io_o] [get_bd_pins join_truth_tables_0/truth_2]
connect_bd_net [get_bd_pins axi_gpio_7/gpio_io_o] [get_bd_pins join_truth_tables_0/truth_3]
connect_bd_net [get_bd_pins axi_gpio_7/gpio2_io_o] [get_bd_pins join_truth_tables_0/truth_4]
connect_bd_net [get_bd_pins axi_gpio_8/gpio_io_o] [get_bd_pins join_truth_tables_0/truth_5]
connect_bd_net [get_bd_pins axi_gpio_8/gpio2_io_o] [get_bd_pins join_truth_tables_0/truth_6]
connect_bd_net [get_bd_pins axi_gpio_9/gpio_io_o] [get_bd_pins join_truth_tables_0/truth_7]
connect_bd_net [get_bd_pins axi_gpio_9/gpio2_io_o] [get_bd_pins join_truth_tables_0/truth_8]
connect_bd_net [get_bd_pins PulseCounter_3/o_value] [get_bd_pins axi_gpio_23/gpio2_io_i]
connect_bd_net [get_bd_pins PulseCounter_2/o_value] [get_bd_pins axi_gpio_23/gpio_io_i]
connect_bd_net [get_bd_pins PulseCounter_1/o_value] [get_bd_pins axi_gpio_22/gpio2_io_i]
connect_bd_net [get_bd_pins PulseCounter_0/o_value] [get_bd_pins axi_gpio_22/gpio_io_i]
connect_bd_net [get_bd_pins axi_gpio_10/gpio_io_o] [get_bd_pins join_truth_tables_1/truth_1]
connect_bd_net [get_bd_pins axi_gpio_10/gpio2_io_o] [get_bd_pins join_truth_tables_1/truth_2]
connect_bd_net [get_bd_pins axi_gpio_11/gpio_io_o] [get_bd_pins join_truth_tables_1/truth_3]
connect_bd_net [get_bd_pins axi_gpio_11/gpio2_io_o] [get_bd_pins join_truth_tables_1/truth_4]
connect_bd_net [get_bd_pins axi_gpio_12/gpio_io_o] [get_bd_pins join_truth_tables_1/truth_5]
connect_bd_net [get_bd_pins axi_gpio_12/gpio2_io_o] [get_bd_pins join_truth_tables_1/truth_6]
connect_bd_net [get_bd_pins axi_gpio_13/gpio_io_o] [get_bd_pins join_truth_tables_1/truth_7]
connect_bd_net [get_bd_pins axi_gpio_13/gpio2_io_o] [get_bd_pins join_truth_tables_1/truth_8]
connect_bd_net [get_bd_pins axi_gpio_17/gpio2_io_o] [get_bd_pins join_truth_tables_2/truth_8]
connect_bd_net [get_bd_pins axi_gpio_17/gpio_io_o] [get_bd_pins join_truth_tables_2/truth_7]
connect_bd_net [get_bd_pins axi_gpio_16/gpio2_io_o] [get_bd_pins join_truth_tables_2/truth_6]
connect_bd_net [get_bd_pins axi_gpio_16/gpio_io_o] [get_bd_pins join_truth_tables_2/truth_5]
connect_bd_net [get_bd_pins axi_gpio_15/gpio2_io_o] [get_bd_pins join_truth_tables_2/truth_4]
connect_bd_net [get_bd_pins axi_gpio_15/gpio_io_o] [get_bd_pins join_truth_tables_2/truth_3]
connect_bd_net [get_bd_pins axi_gpio_14/gpio2_io_o] [get_bd_pins join_truth_tables_2/truth_2]
connect_bd_net [get_bd_pins axi_gpio_14/gpio_io_o] [get_bd_pins join_truth_tables_2/truth_1]
connect_bd_net [get_bd_pins axi_gpio_21/gpio2_io_o] [get_bd_pins join_truth_tables_3/truth_8]
connect_bd_net [get_bd_pins axi_gpio_21/gpio_io_o] [get_bd_pins join_truth_tables_3/truth_7]
connect_bd_net [get_bd_pins axi_gpio_20/gpio2_io_o] [get_bd_pins join_truth_tables_3/truth_6]
connect_bd_net [get_bd_pins axi_gpio_20/gpio_io_o] [get_bd_pins join_truth_tables_3/truth_5]
connect_bd_net [get_bd_pins axi_gpio_19/gpio2_io_o] [get_bd_pins join_truth_tables_3/truth_4]
connect_bd_net [get_bd_pins axi_gpio_19/gpio_io_o] [get_bd_pins join_truth_tables_3/truth_3]
connect_bd_net [get_bd_pins axi_gpio_18/gpio2_io_o] [get_bd_pins join_truth_tables_3/truth_2]
connect_bd_net [get_bd_pins axi_gpio_18/gpio_io_o] [get_bd_pins join_truth_tables_3/truth_1]
connect_bd_net [get_bd_pins join_truth_tables_0/truth_allout] [get_bd_pins OutputLogic_0/truthtable_1] [get_bd_pins DisplayLEDs_0/i_vector]
connect_bd_net [get_bd_pins join_truth_tables_1/truth_allout] [get_bd_pins OutputLogic_0/truthtable_2]
connect_bd_net [get_bd_pins join_truth_tables_2/truth_allout] [get_bd_pins OutputLogic_0/truthtable_3]
connect_bd_net [get_bd_pins join_truth_tables_3/truth_allout] [get_bd_pins OutputLogic_0/truthtable_4]

# ---- address map ----
assign_bd_address -offset 0x41200000 -range 64K -target_address_space [get_bd_addr_spaces processing_system7_0/Data] [get_bd_addr_segs axi_gpio_0/S_AXI/Reg]
assign_bd_address -offset 0x41210000 -range 64K -target_address_space [get_bd_addr_spaces processing_system7_0/Data] [get_bd_addr_segs axi_gpio_1/S_AXI/Reg]
assign_bd_address -offset 0x41220000 -range 64K -target_address_space [get_bd_addr_spaces processing_system7_0/Data] [get_bd_addr_segs axi_gpio_2/S_AXI/Reg]
assign_bd_address -offset 0x41230000 -range 64K -target_address_space [get_bd_addr_spaces processing_system7_0/Data] [get_bd_addr_segs axi_gpio_3/S_AXI/Reg]
assign_bd_address -offset 0x41240000 -range 64K -target_address_space [get_bd_addr_spaces processing_system7_0/Data] [get_bd_addr_segs axi_gpio_4/S_AXI/Reg]
assign_bd_address -offset 0x41250000 -range 64K -target_address_space [get_bd_addr_spaces processing_system7_0/Data] [get_bd_addr_segs axi_gpio_5/S_AXI/Reg]
assign_bd_address -offset 0x41260000 -range 64K -target_address_space [get_bd_addr_spaces processing_system7_0/Data] [get_bd_addr_segs axi_gpio_6/S_AXI/Reg]
assign_bd_address -offset 0x41270000 -range 64K -target_address_space [get_bd_addr_spaces processing_system7_0/Data] [get_bd_addr_segs axi_gpio_7/S_AXI/Reg]
assign_bd_address -offset 0x41280000 -range 64K -target_address_space [get_bd_addr_spaces processing_system7_0/Data] [get_bd_addr_segs axi_gpio_8/S_AXI/Reg]
assign_bd_address -offset 0x41290000 -range 64K -target_address_space [get_bd_addr_spaces processing_system7_0/Data] [get_bd_addr_segs axi_gpio_9/S_AXI/Reg]
assign_bd_address -offset 0x412A0000 -range 64K -target_address_space [get_bd_addr_spaces processing_system7_0/Data] [get_bd_addr_segs axi_gpio_10/S_AXI/Reg]
assign_bd_address -offset 0x412B0000 -range 64K -target_address_space [get_bd_addr_spaces processing_system7_0/Data] [get_bd_addr_segs axi_gpio_11/S_AXI/Reg]
assign_bd_address -offset 0x412C0000 -range 64K -target_address_space [get_bd_addr_spaces processing_system7_0/Data] [get_bd_addr_segs axi_gpio_12/S_AXI/Reg]
assign_bd_address -offset 0x412D0000 -range 64K -target_address_space [get_bd_addr_spaces processing_system7_0/Data] [get_bd_addr_segs axi_gpio_13/S_AXI/Reg]
assign_bd_address -offset 0x412E0000 -range 64K -target_address_space [get_bd_addr_spaces processing_system7_0/Data] [get_bd_addr_segs axi_gpio_14/S_AXI/Reg]
assign_bd_address -offset 0x412F0000 -range 64K -target_address_space [get_bd_addr_spaces processing_system7_0/Data] [get_bd_addr_segs axi_gpio_15/S_AXI/Reg]
assign_bd_address -offset 0x41300000 -range 64K -target_address_space [get_bd_addr_spaces processing_system7_0/Data] [get_bd_addr_segs axi_gpio_16/S_AXI/Reg]
assign_bd_address -offset 0x41310000 -range 64K -target_address_space [get_bd_addr_spaces processing_system7_0/Data] [get_bd_addr_segs axi_gpio_17/S_AXI/Reg]
assign_bd_address -offset 0x41320000 -range 64K -target_address_space [get_bd_addr_spaces processing_system7_0/Data] [get_bd_addr_segs axi_gpio_18/S_AXI/Reg]
assign_bd_address -offset 0x41330000 -range 64K -target_address_space [get_bd_addr_spaces processing_system7_0/Data] [get_bd_addr_segs axi_gpio_19/S_AXI/Reg]
assign_bd_address -offset 0x41340000 -range 64K -target_address_space [get_bd_addr_spaces processing_system7_0/Data] [get_bd_addr_segs axi_gpio_20/S_AXI/Reg]
assign_bd_address -offset 0x41350000 -range 64K -target_address_space [get_bd_addr_spaces processing_system7_0/Data] [get_bd_addr_segs axi_gpio_21/S_AXI/Reg]
assign_bd_address -offset 0x41360000 -range 64K -target_address_space [get_bd_addr_spaces processing_system7_0/Data] [get_bd_addr_segs axi_gpio_22/S_AXI/Reg]
assign_bd_address -offset 0x41370000 -range 64K -target_address_space [get_bd_addr_spaces processing_system7_0/Data] [get_bd_addr_segs axi_gpio_23/S_AXI/Reg]

validate_bd_design
save_bd_design
